# EAGLE design pro-radio (EAGLE 5.10)
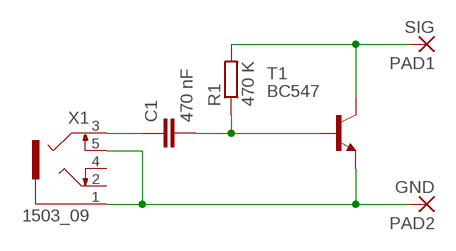
[diagram p0: schematic, sheet 1]

## Parts
C1  470 nF  C-EU075-032X103  [C075-032X103]
PAD1  SIG  2,15/1,0  [2,15/1,0]
PAD2  GND  2,15/1,0  [2,15/1,0]
R1  470 K  R-EU_0207/10  [0207/10]
T1  BC547  [TO92]
X1  1503_09  [1503_09]

## Nets
N$1: C1.1 X1.3
N$2: C1.2 R1.1 T1.2(B)
N$3: PAD1.1(P) R1.2 T1.3(C)
N$4: PAD2.1(P) T1.1(E) X1.1 X1.5
Unconnected: X1.2 X1.4

## Library data of the parts
C1 = rcl:C-EU: CAPACITOR, European symbol
PAD1 PAD2 = wirepad:2,15/1,0: THROUGH-HOLE PAD
R1 = resistor:R-EU_: RESISTOR, European symbol
T1 = transistor:BC547: NPN TRANSISTOR
X1 = con-lumberg:1503_09: Jack connectors according to JISC 6560, 3.5 mm Klinkeneinbaukupplung nach JISC 6560, 3,5 mm, 3-polig/ stereo, abgewinkelte Ausführung, mit 2 Öffnern und Lötaugen, für Leiterplatten Rückseitenmontage Source: http://www.lumberg.com/Produkte/PDFs/1503_09.pdf

## Board
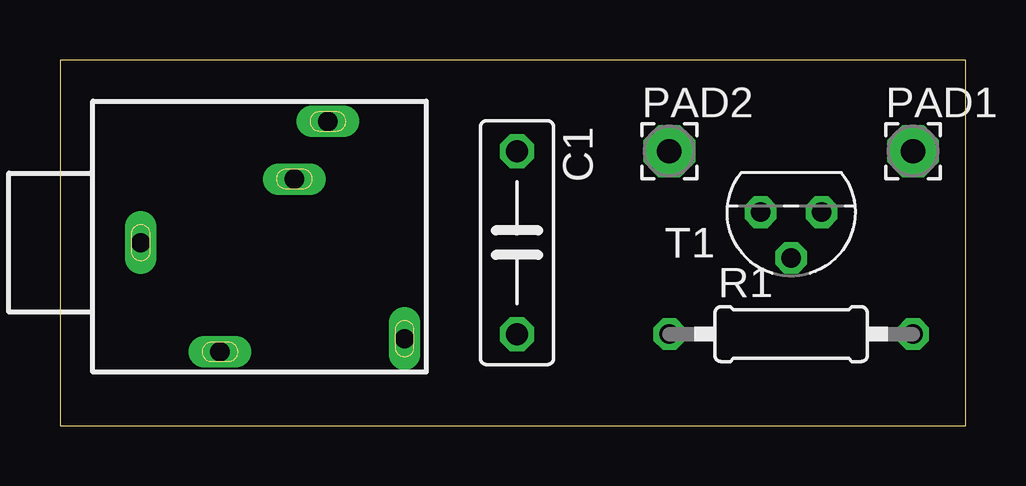
[diagram p1: board, top side]
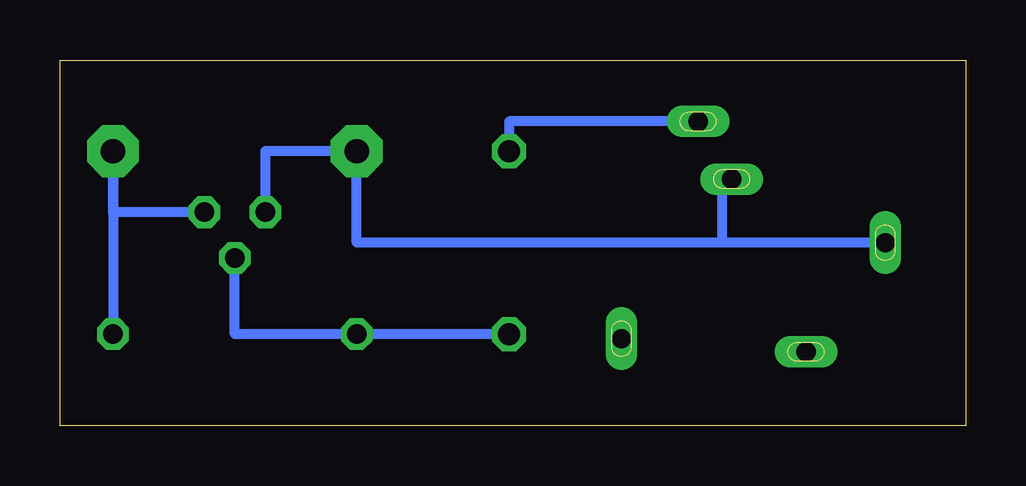
[diagram p2: board, bottom side, seen from below]

Size 37.77 x 15.23 mm. Coordinates in mm from the lower left corner, seen from the top.
Outline: 0,0 37.77,0 37.77,15.23 0,15.23 0,0
Copper layers 16: Bottom 0.035mm
Design rules "default *": minimum track width 10mil, minimum drill 24mil, track to track 8mil, track to pad 8mil, pad to pad 8mil, via to via 8mil, smd to smd 8mil, copper to edge 40mil, drill to drill 8mil, minimum pad ring 10mil, minimum via ring 8mil, stop-mask expansion 4mil, vias tented up to drill 0mil, thermal gap 10mil

### Footprints (pad centres in the part's own frame; a part is rotated, then mirrored left to right if it is on the bottom)
C075-032X103 = drill 0.914 octagon: 1 -3.81,0; 2 3.81,0
2,15/1,0 = drill 1.016 pad 2.159 octagon: 1 0,0
0207/10 = drill 0.813 octagon: 1 -5.08,0; 2 5.08,0
TO92 = drill 0.813 octagon: 1 1.27,0; 2 0,1.905; 3 -1.27,0
1503_09 = drill 0.8 pad 1.2 long: 1 0,-2.1; 2 -4.55,-5.4; 3 5.05,-9.9; 4 -4,-13.1; 5 2.65,-8.5

### Placement (x,y rotation side)
C1  19.05,7.62 270 top
PAD1  35.56,11.43 0 top
PAD2  25.4,11.43 0 top
R1  30.48,3.81 0 top
T1  30.48,8.89 180 top
X1  1.27,7.62 90 top

### Tracks (layer width: path | path; a pad name or v marks a point on that pad's centre or on a via)
N$1
  Bottom 0.406: X1.3 19.05,12.67 C1.1
N$2
  Bottom 0.406: C1.2 R1.1 30.48,3.81 T1.2
N$3
  Bottom 0.406: T1.3 35.56,8.89 PAD1.1 R1.2
N$4
  Bottom 0.406: X1.1 10.16,7.62 | 10.16,7.62 25.4,7.62 PAD2.1 29.21,11.43 T1.1 | X1.5 10.16,10.27 10.16,7.62